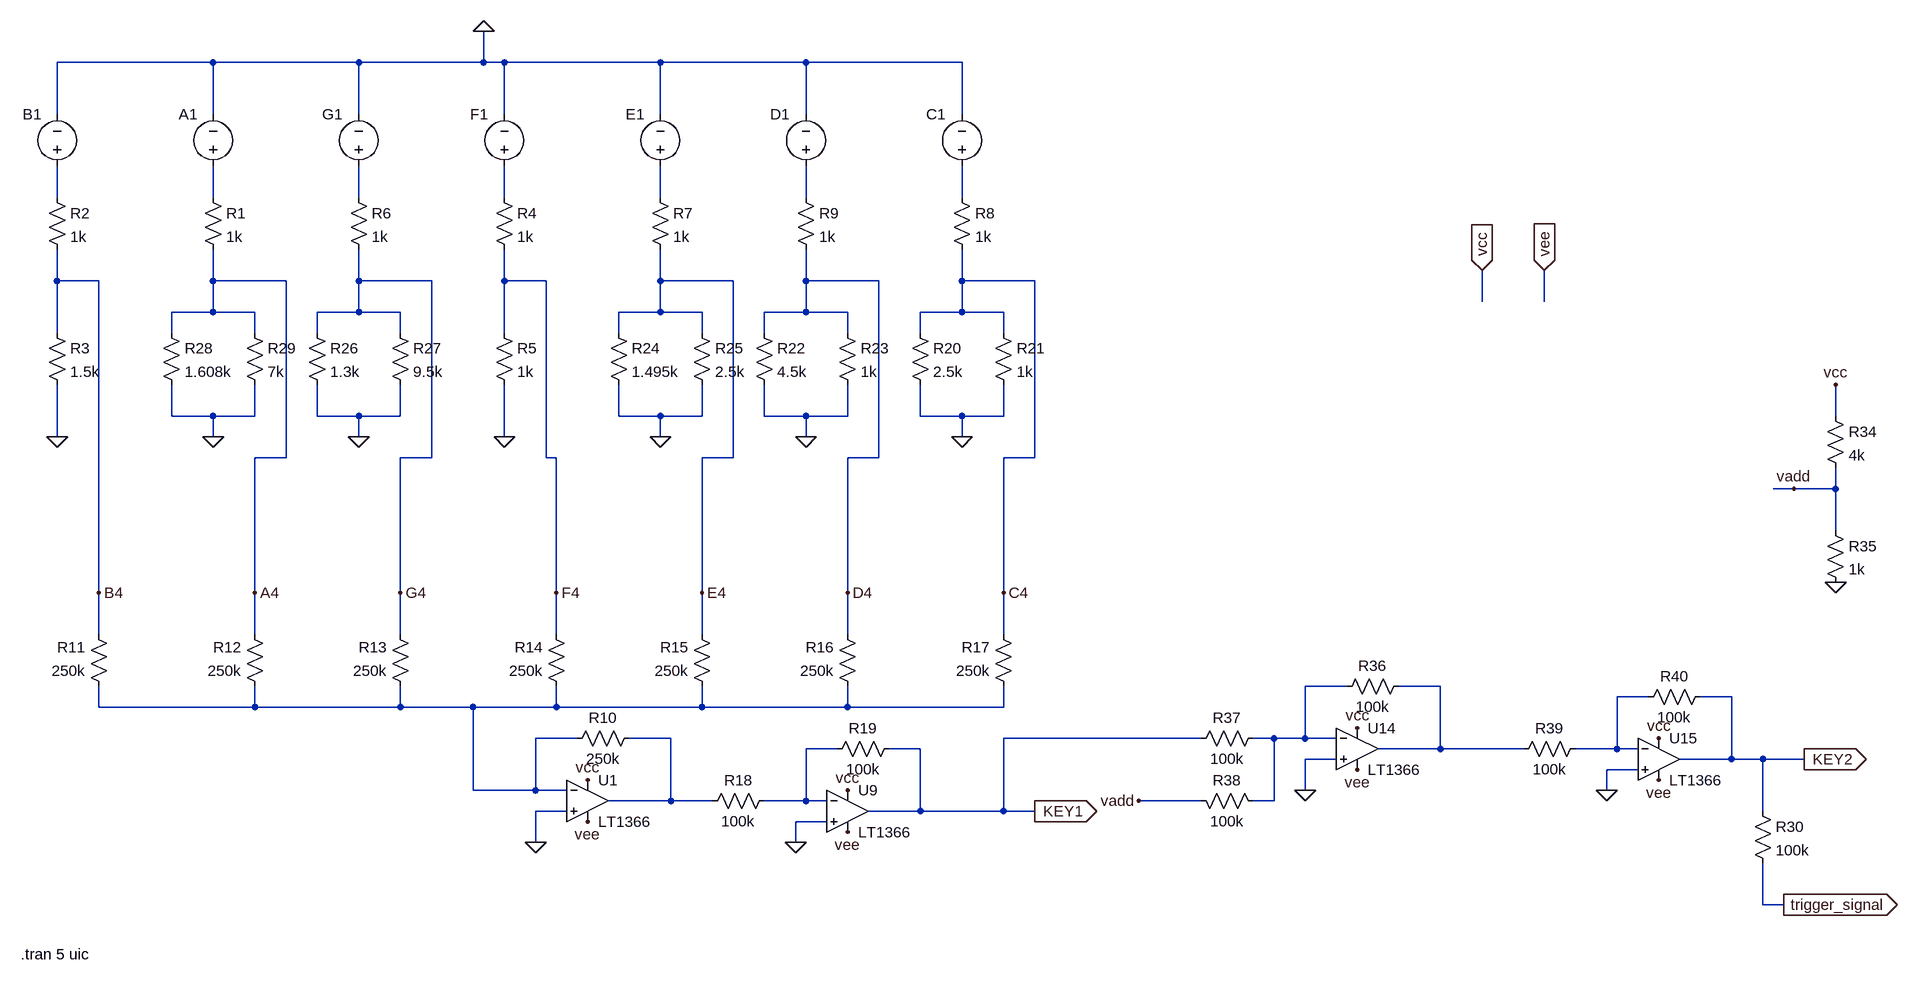
[diagram p0: schematic 3.6second_keyboard_hopefully_final_cheaper.asc]
3.6second_keyboard_hopefully_final_cheaper.asc, the LTspice schematic file:
Version 4
SHEET 1 2644 1832
WIRE -2688 -416 -2928 -416
WIRE -2464 -416 -2688 -416
WIRE -2272 -416 -2272 -464
WIRE -2272 -416 -2464 -416
WIRE -2240 -416 -2272 -416
WIRE -2000 -416 -2240 -416
WIRE -1776 -416 -2000 -416
WIRE -1536 -416 -1776 -416
WIRE -2928 -336 -2928 -416
WIRE -2688 -336 -2688 -416
WIRE -2464 -336 -2464 -416
WIRE -2240 -336 -2240 -416
WIRE -2000 -336 -2000 -416
WIRE -1776 -336 -1776 -416
WIRE -1536 -336 -1536 -416
WIRE -2928 -208 -2928 -256
WIRE -2688 -208 -2688 -256
WIRE -2464 -208 -2464 -256
WIRE -2240 -208 -2240 -256
WIRE -2000 -208 -2000 -256
WIRE -1776 -208 -1776 -256
WIRE -1536 -208 -1536 -256
WIRE -2928 -80 -2928 -128
WIRE -2864 -80 -2928 -80
WIRE -2688 -80 -2688 -128
WIRE -2576 -80 -2688 -80
WIRE -2464 -80 -2464 -128
WIRE -2352 -80 -2464 -80
WIRE -2240 -80 -2240 -128
WIRE -2176 -80 -2240 -80
WIRE -2000 -80 -2000 -128
WIRE -1888 -80 -2000 -80
WIRE -1776 -80 -1776 -128
WIRE -1664 -80 -1776 -80
WIRE -1536 -80 -1536 -128
WIRE -1424 -80 -1536 -80
WIRE -736 -48 -736 -96
WIRE -640 -48 -640 -96
WIRE -2688 -32 -2688 -80
WIRE -2688 -32 -2752 -32
WIRE -2624 -32 -2688 -32
WIRE -2464 -32 -2464 -80
WIRE -2464 -32 -2528 -32
WIRE -2400 -32 -2464 -32
WIRE -2000 -32 -2000 -80
WIRE -2000 -32 -2064 -32
WIRE -1936 -32 -2000 -32
WIRE -1776 -32 -1776 -80
WIRE -1776 -32 -1840 -32
WIRE -1712 -32 -1776 -32
WIRE -1536 -32 -1536 -80
WIRE -1536 -32 -1600 -32
WIRE -1472 -32 -1536 -32
WIRE -2928 0 -2928 -80
WIRE -2752 0 -2752 -32
WIRE -2624 0 -2624 -32
WIRE -2528 0 -2528 -32
WIRE -2400 0 -2400 -32
WIRE -2240 0 -2240 -80
WIRE -2064 0 -2064 -32
WIRE -1936 0 -1936 -32
WIRE -1840 0 -1840 -32
WIRE -1712 0 -1712 -32
WIRE -1600 0 -1600 -32
WIRE -1472 0 -1472 -32
WIRE -2752 128 -2752 80
WIRE -2688 128 -2752 128
WIRE -2624 128 -2624 80
WIRE -2624 128 -2688 128
WIRE -2528 128 -2528 80
WIRE -2464 128 -2528 128
WIRE -2400 128 -2400 80
WIRE -2400 128 -2464 128
WIRE -2064 128 -2064 80
WIRE -2000 128 -2064 128
WIRE -1936 128 -1936 80
WIRE -1936 128 -2000 128
WIRE -1840 128 -1840 80
WIRE -1776 128 -1840 128
WIRE -1712 128 -1712 80
WIRE -1712 128 -1776 128
WIRE -1600 128 -1600 80
WIRE -1536 128 -1600 128
WIRE -1472 128 -1472 80
WIRE -1472 128 -1536 128
WIRE -192 128 -192 80
WIRE -2928 160 -2928 80
WIRE -2688 160 -2688 128
WIRE -2464 160 -2464 128
WIRE -2240 160 -2240 80
WIRE -2000 160 -2000 128
WIRE -1776 160 -1776 128
WIRE -1536 160 -1536 128
WIRE -2576 192 -2576 -80
WIRE -2576 192 -2624 192
WIRE -2352 192 -2352 -80
WIRE -2352 192 -2400 192
WIRE -2176 192 -2176 -80
WIRE -2160 192 -2176 192
WIRE -1888 192 -1888 -80
WIRE -1888 192 -1936 192
WIRE -1664 192 -1664 -80
WIRE -1664 192 -1712 192
WIRE -1424 192 -1424 -80
WIRE -1424 192 -1472 192
WIRE -256 240 -288 240
WIRE -192 240 -192 208
WIRE -192 240 -256 240
WIRE -192 304 -192 240
WIRE -2864 400 -2864 -80
WIRE -2624 400 -2624 192
WIRE -2400 400 -2400 192
WIRE -2160 400 -2160 192
WIRE -1936 400 -1936 192
WIRE -1712 400 -1712 192
WIRE -1472 400 -1472 192
WIRE -2864 464 -2864 400
WIRE -2624 464 -2624 400
WIRE -2400 464 -2400 400
WIRE -2160 464 -2160 400
WIRE -1936 464 -1936 400
WIRE -1712 464 -1712 400
WIRE -1472 464 -1472 400
WIRE -944 544 -1008 544
WIRE -800 544 -864 544
WIRE -480 560 -528 560
WIRE -352 560 -400 560
WIRE -2864 576 -2864 544
WIRE -2624 576 -2624 544
WIRE -2624 576 -2864 576
WIRE -2400 576 -2400 544
WIRE -2400 576 -2624 576
WIRE -2288 576 -2400 576
WIRE -2160 576 -2160 544
WIRE -2160 576 -2288 576
WIRE -1936 576 -1936 544
WIRE -1936 576 -2160 576
WIRE -1712 576 -1712 544
WIRE -1712 576 -1936 576
WIRE -1472 576 -1472 544
WIRE -1472 576 -1712 576
WIRE -2128 624 -2192 624
WIRE -1984 624 -2048 624
WIRE -1168 624 -1472 624
WIRE -1056 624 -1088 624
WIRE -1008 624 -1008 544
WIRE -1008 624 -1056 624
WIRE -960 624 -1008 624
WIRE -1728 640 -1776 640
WIRE -1600 640 -1648 640
WIRE -800 640 -800 544
WIRE -800 640 -896 640
WIRE -672 640 -800 640
WIRE -528 640 -528 560
WIRE -528 640 -592 640
WIRE -496 640 -528 640
WIRE -960 656 -1008 656
WIRE -352 656 -352 560
WIRE -352 656 -432 656
WIRE -304 656 -352 656
WIRE -240 656 -304 656
WIRE -496 672 -544 672
WIRE -2288 704 -2288 576
WIRE -2192 704 -2192 624
WIRE -2192 704 -2288 704
WIRE -2144 704 -2192 704
WIRE -1008 704 -1008 656
WIRE -544 704 -544 672
WIRE -1984 720 -1984 624
WIRE -1984 720 -2080 720
WIRE -1920 720 -1984 720
WIRE -1776 720 -1776 640
WIRE -1776 720 -1840 720
WIRE -1744 720 -1776 720
WIRE -1168 720 -1264 720
WIRE -1056 720 -1056 624
WIRE -1056 720 -1088 720
WIRE -2144 736 -2192 736
WIRE -1600 736 -1600 640
WIRE -1600 736 -1680 736
WIRE -1472 736 -1472 624
WIRE -1472 736 -1600 736
WIRE -1424 736 -1472 736
WIRE -304 736 -304 656
WIRE -1744 752 -1792 752
WIRE -2192 784 -2192 736
WIRE -1792 784 -1792 752
WIRE -304 880 -304 816
WIRE -272 880 -304 880
FLAG -2272 -464 0
FLAG -1472 400 C4
FLAG -1712 400 D4
FLAG -1936 400 E4
FLAG -2160 400 F4
FLAG -2400 400 G4
FLAG -2624 400 A4
FLAG -2864 400 B4
FLAG -2192 784 0
FLAG -1792 784 0
FLAG -1424 736 KEY1
IOPIN -1424 736 Out
FLAG -1536 160 0
FLAG -1776 160 0
FLAG -2000 160 0
FLAG -2464 160 0
FLAG -2688 160 0
FLAG -2928 160 0
FLAG -2240 160 0
FLAG -272 880 trigger_signal
IOPIN -272 880 Out
FLAG -192 384 0
FLAG -192 80 vcc
FLAG -1008 704 0
FLAG -256 240 vadd
FLAG -1264 720 vadd
FLAG -544 704 0
FLAG -240 656 KEY2
IOPIN -240 656 Out
FLAG -1712 704 vcc
FLAG -2112 688 vcc
FLAG -928 608 vcc
FLAG -2112 752 vee
FLAG -1712 768 vee
FLAG -928 672 vee
FLAG -464 688 vee
FLAG -464 624 vcc
FLAG -736 -96 vcc
IOPIN -736 -96 In
FLAG -640 -96 vee
IOPIN -640 -96 In
SYMBOL res -2704 -224 R0
SYMATTR InstName R1
SYMATTR Value 1k
SYMBOL res -2944 -224 R0
SYMATTR InstName R2
SYMATTR Value 1k
SYMBOL res -2944 -16 R0
SYMATTR InstName R3
SYMATTR Value 1.5k
SYMBOL res -2256 -224 R0
SYMATTR InstName R4
SYMATTR Value 1k
SYMBOL res -2256 -16 R0
SYMATTR InstName R5
SYMATTR Value 1k
SYMBOL res -2480 -224 R0
SYMATTR InstName R6
SYMATTR Value 1k
SYMBOL res -2016 -224 R0
SYMATTR InstName R7
SYMATTR Value 1k
SYMBOL res -1552 -224 R0
SYMATTR InstName R8
SYMATTR Value 1k
SYMBOL res -1792 -224 R0
SYMATTR InstName R9
SYMATTR Value 1k
SYMBOL voltage -2928 -240 R180
WINDOW 0 24 96 Left 2
WINDOW 3 24 16 Invisible 2
WINDOW 123 0 0 Left 0
WINDOW 39 0 0 Left 0
SYMATTR InstName B1
SYMATTR Value PWL(24.55 0 24.550000000001 5 28.15 5 28.150000000001 0)
SYMBOL voltage -2688 -240 R180
WINDOW 0 24 96 Left 2
WINDOW 3 24 16 Invisible 2
WINDOW 123 0 0 Left 0
WINDOW 39 0 0 Left 0
SYMATTR InstName A1
SYMATTR Value PWL(20.45 0 20.450000000001 5 24.05 5 24.050000000001 0)
SYMBOL voltage -2464 -240 R180
WINDOW 0 24 96 Left 2
WINDOW 3 24 68 Invisible 2
WINDOW 123 0 0 Left 0
WINDOW 39 0 0 Left 0
SYMATTR InstName G1
SYMATTR Value PWL(16.35 0 16.350000000001 5 19.95 5 19.950000000001 0)
SYMBOL voltage -2240 -240 R180
WINDOW 0 24 96 Left 2
WINDOW 3 24 68 Invisible 2
WINDOW 123 0 0 Left 0
WINDOW 39 0 0 Left 0
SYMATTR InstName F1
SYMATTR Value PWL(12.25 0 12.250000000001 5 15.85 5 15.850000000001 0)
SYMBOL voltage -2000 -240 R180
WINDOW 0 24 96 Left 2
WINDOW 3 24 68 Invisible 2
WINDOW 123 0 0 Left 0
WINDOW 39 0 0 Left 0
SYMATTR InstName E1
SYMATTR Value PWL(8.15 0 8.150000000001 5 11.75 5 11.750000000001 0)
SYMBOL voltage -1776 -240 R180
WINDOW 0 24 96 Left 2
WINDOW 3 24 68 Invisible 2
WINDOW 123 0 0 Left 0
WINDOW 39 0 0 Left 0
SYMATTR InstName D1
SYMATTR Value PWL(4.05 0 4.050000000001 5 7.65 5 7.650000000001 0)
SYMBOL voltage -1536 -240 R180
WINDOW 0 24 96 Left 2
WINDOW 3 24 68 Invisible 2
WINDOW 123 0 0 Left 0
WINDOW 39 0 0 Left 0
SYMATTR InstName C1
SYMATTR Value PWL(0 0 0.049999999999 0 0.05 5 3.65 5 3.650000000001 0)
SYMBOL Opamps\\LT1366 -2112 656 R0
SYMATTR InstName U1
SYMBOL res -2032 608 R90
WINDOW 0 0 56 VBottom 2
WINDOW 3 32 56 VTop 2
SYMATTR InstName R10
SYMATTR Value 250k
SYMBOL res -2848 560 R180
WINDOW 0 36 76 Left 2
WINDOW 3 36 40 Left 2
SYMATTR InstName R11
SYMATTR Value 250k
SYMBOL res -2608 560 R180
WINDOW 0 36 76 Left 2
WINDOW 3 36 40 Left 2
SYMATTR InstName R12
SYMATTR Value 250k
SYMBOL res -2384 560 R180
WINDOW 0 36 76 Left 2
WINDOW 3 36 40 Left 2
SYMATTR InstName R13
SYMATTR Value 250k
SYMBOL res -2144 560 R180
WINDOW 0 36 76 Left 2
WINDOW 3 36 40 Left 2
SYMATTR InstName R14
SYMATTR Value 250k
SYMBOL res -1920 560 R180
WINDOW 0 36 76 Left 2
WINDOW 3 36 40 Left 2
SYMATTR InstName R15
SYMATTR Value 250k
SYMBOL res -1696 560 R180
WINDOW 0 36 76 Left 2
WINDOW 3 36 40 Left 2
SYMATTR InstName R16
SYMATTR Value 250k
SYMBOL res -1456 560 R180
WINDOW 0 36 76 Left 2
WINDOW 3 36 40 Left 2
SYMATTR InstName R17
SYMATTR Value 250k
SYMBOL Opamps\\LT1366 -1712 672 R0
SYMATTR InstName U9
SYMBOL res -1824 704 R90
WINDOW 0 0 56 VBottom 2
WINDOW 3 32 56 VTop 2
SYMATTR InstName R18
SYMATTR Value 100k
SYMBOL res -1632 624 R90
WINDOW 0 0 56 VBottom 2
WINDOW 3 32 56 VTop 2
SYMATTR InstName R19
SYMATTR Value 100k
SYMBOL res -1616 -16 R0
SYMATTR InstName R20
SYMATTR Value 2.5k
SYMBOL res -1488 -16 R0
SYMATTR InstName R21
SYMATTR Value 1k
SYMBOL res -1856 -16 R0
SYMATTR InstName R22
SYMATTR Value 4.5k
SYMBOL res -1728 -16 R0
SYMATTR InstName R23
SYMATTR Value 1k
SYMBOL res -2080 -16 R0
SYMATTR InstName R24
SYMATTR Value 1.495k
SYMBOL res -1952 -16 R0
SYMATTR InstName R25
SYMATTR Value 2.5k
SYMBOL res -2544 -16 R0
SYMATTR InstName R26
SYMATTR Value 1.3k
SYMBOL res -2416 -16 R0
SYMATTR InstName R27
SYMATTR Value 9.5k
SYMBOL res -2768 -16 R0
SYMATTR InstName R28
SYMATTR Value 1.608k
SYMBOL res -2640 -16 R0
SYMATTR InstName R29
SYMATTR Value 7k
SYMBOL res -208 112 R0
SYMATTR InstName R34
SYMATTR Value 4k
SYMBOL res -208 288 R0
SYMATTR InstName R35
SYMATTR Value 1k
SYMBOL Opamps\\LT1366 -928 576 R0
SYMATTR InstName U14
SYMBOL res -848 528 R90
WINDOW 0 0 56 VBottom 2
WINDOW 3 32 56 VTop 2
SYMATTR InstName R36
SYMATTR Value 100k
SYMBOL res -1072 608 R90
WINDOW 0 0 56 VBottom 2
WINDOW 3 32 56 VTop 2
SYMATTR InstName R37
SYMATTR Value 100k
SYMBOL res -1184 704 M90
WINDOW 0 0 56 VBottom 2
WINDOW 3 32 56 VTop 2
SYMATTR InstName R38
SYMATTR Value 100k
SYMBOL Opamps\\LT1366 -464 592 R0
SYMATTR InstName U15
SYMBOL res -576 624 R90
WINDOW 0 0 56 VBottom 2
WINDOW 3 32 56 VTop 2
SYMATTR InstName R39
SYMATTR Value 100k
SYMBOL res -384 544 R90
WINDOW 0 0 56 VBottom 2
WINDOW 3 32 56 VTop 2
SYMATTR InstName R40
SYMATTR Value 100k
SYMBOL res -320 720 R0
SYMATTR InstName R30
SYMATTR Value 100k
TEXT -2984 956 Left 2 !.tran 5 uic

The netlist it stands for:
* 3.6second_keyboard_hopefully_final_cheaper.asc
R1 N002 A4 1k
R2 N001 B4 1k
R3 B4 0 1.5k
R4 N004 F4 1k
R5 F4 0 1k
R6 N003 G4 1k
R7 N005 E4 1k
R8 N007 C4 1k
R9 N006 D4 1k
V§B1 N001 0 PWL(24.55 0 24.550000000001 5 28.15 5 28.150000000001 0)
V§A1 N002 0 PWL(20.45 0 20.450000000001 5 24.05 5 24.050000000001 0)
V§G1 N003 0 PWL(16.35 0 16.350000000001 5 19.95 5 19.950000000001 0)
V§F1 N004 0 PWL(12.25 0 12.250000000001 5 15.85 5 15.850000000001 0)
V§E1 N005 0 PWL(8.15 0 8.150000000001 5 11.75 5 11.750000000001 0)
V§D1 N006 0 PWL(4.05 0 4.050000000001 5 7.65 5 7.650000000001 0)
V§C1 N007 0 PWL(0 0 0.049999999999 0 0.05 5 3.65 5 3.650000000001 0)
XU1 0 N011 vcc vee N012 LT1366  ; pins In+ In- V+ V- OUT
R10 N012 N011 250k
R11 N011 B4 250k
R12 N011 A4 250k
R13 N011 G4 250k
R14 N011 F4 250k
R15 N011 E4 250k
R16 N011 D4 250k
R17 N011 C4 250k
XU9 0 N013 vcc vee KEY1 LT1366  ; pins In+ In- V+ V- OUT
R18 N013 N012 100k
R19 KEY1 N013 100k
R20 C4 0 2.5k
R21 C4 0 1k
R22 D4 0 4.5k
R23 D4 0 1k
R24 E4 0 1.495k
R25 E4 0 2.5k
R26 G4 0 1.3k
R27 G4 0 9.5k
R28 A4 0 1.608k
R29 A4 0 7k
R34 vcc vadd 4k
R35 vadd 0 1k
XU14 0 N008 vcc vee N009 LT1366  ; pins In+ In- V+ V- OUT
R36 N009 N008 100k
R37 N008 KEY1 100k
R38 vadd N008 100k
XU15 0 N010 vcc vee KEY2 LT1366  ; pins In+ In- V+ V- OUT
R39 N010 N009 100k
R40 KEY2 N010 100k
R30 KEY2 trigger_signal 100k
.tran 5 uic
.lib LTC.lib
.backanno
.end